# EAGLE board main_smd_first_draft (EAGLE 9.0.0), part 1 of 2
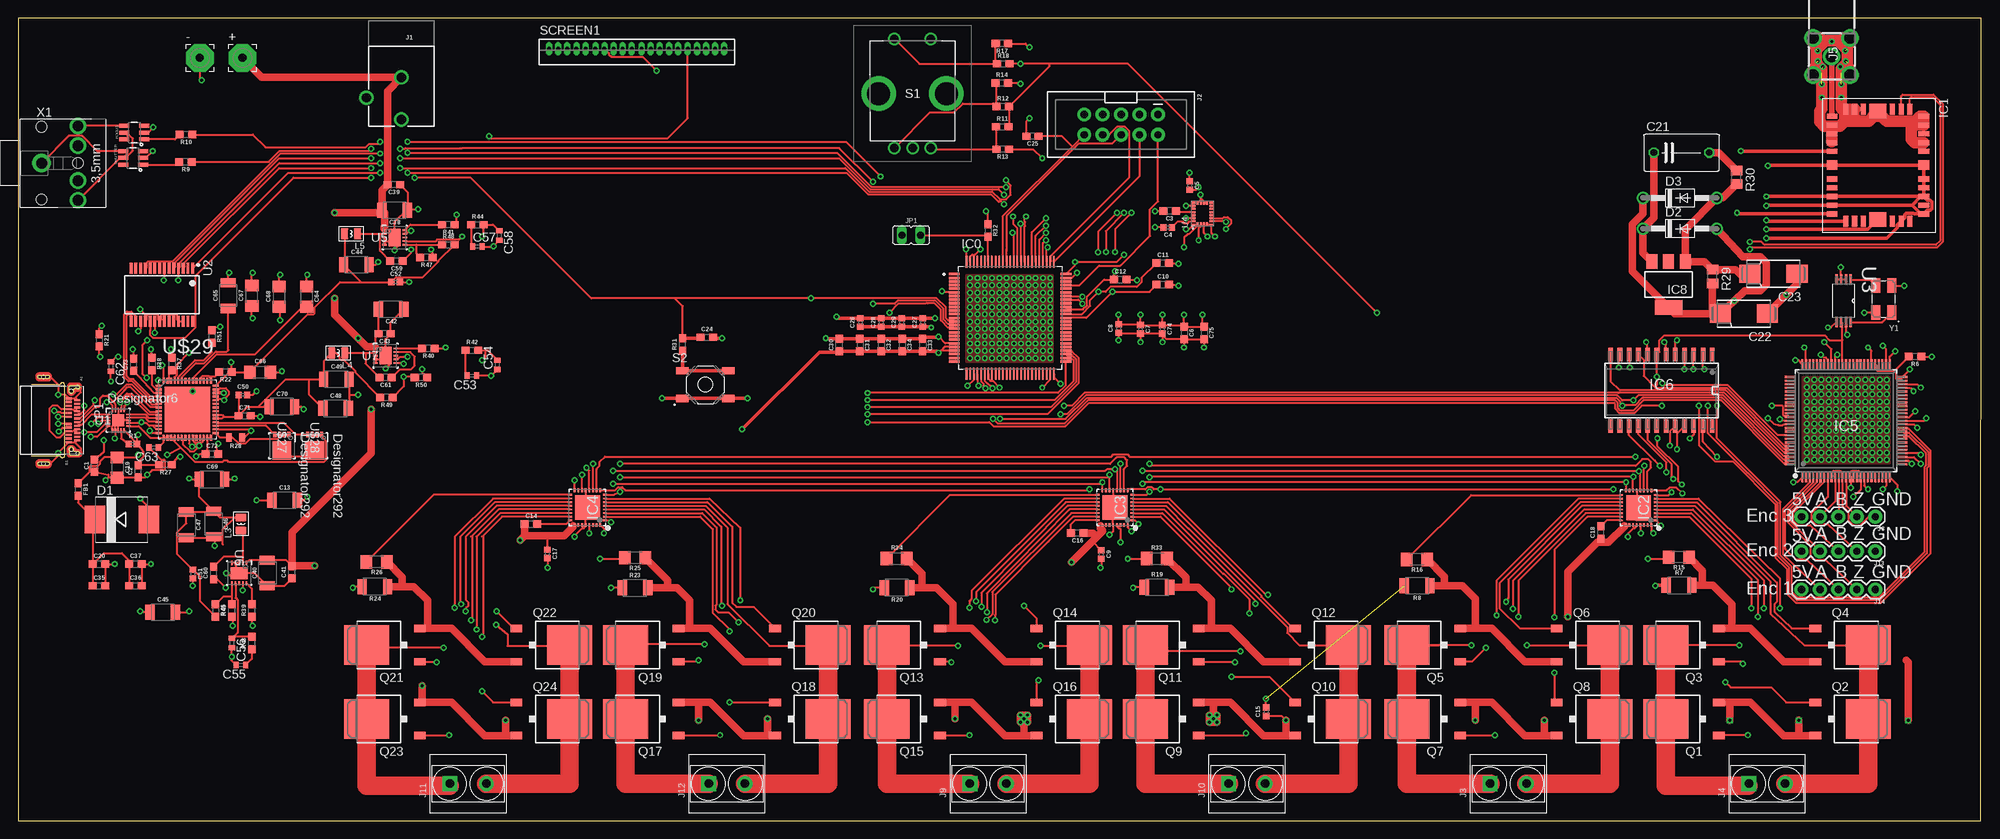
[diagram p9: board, top side]
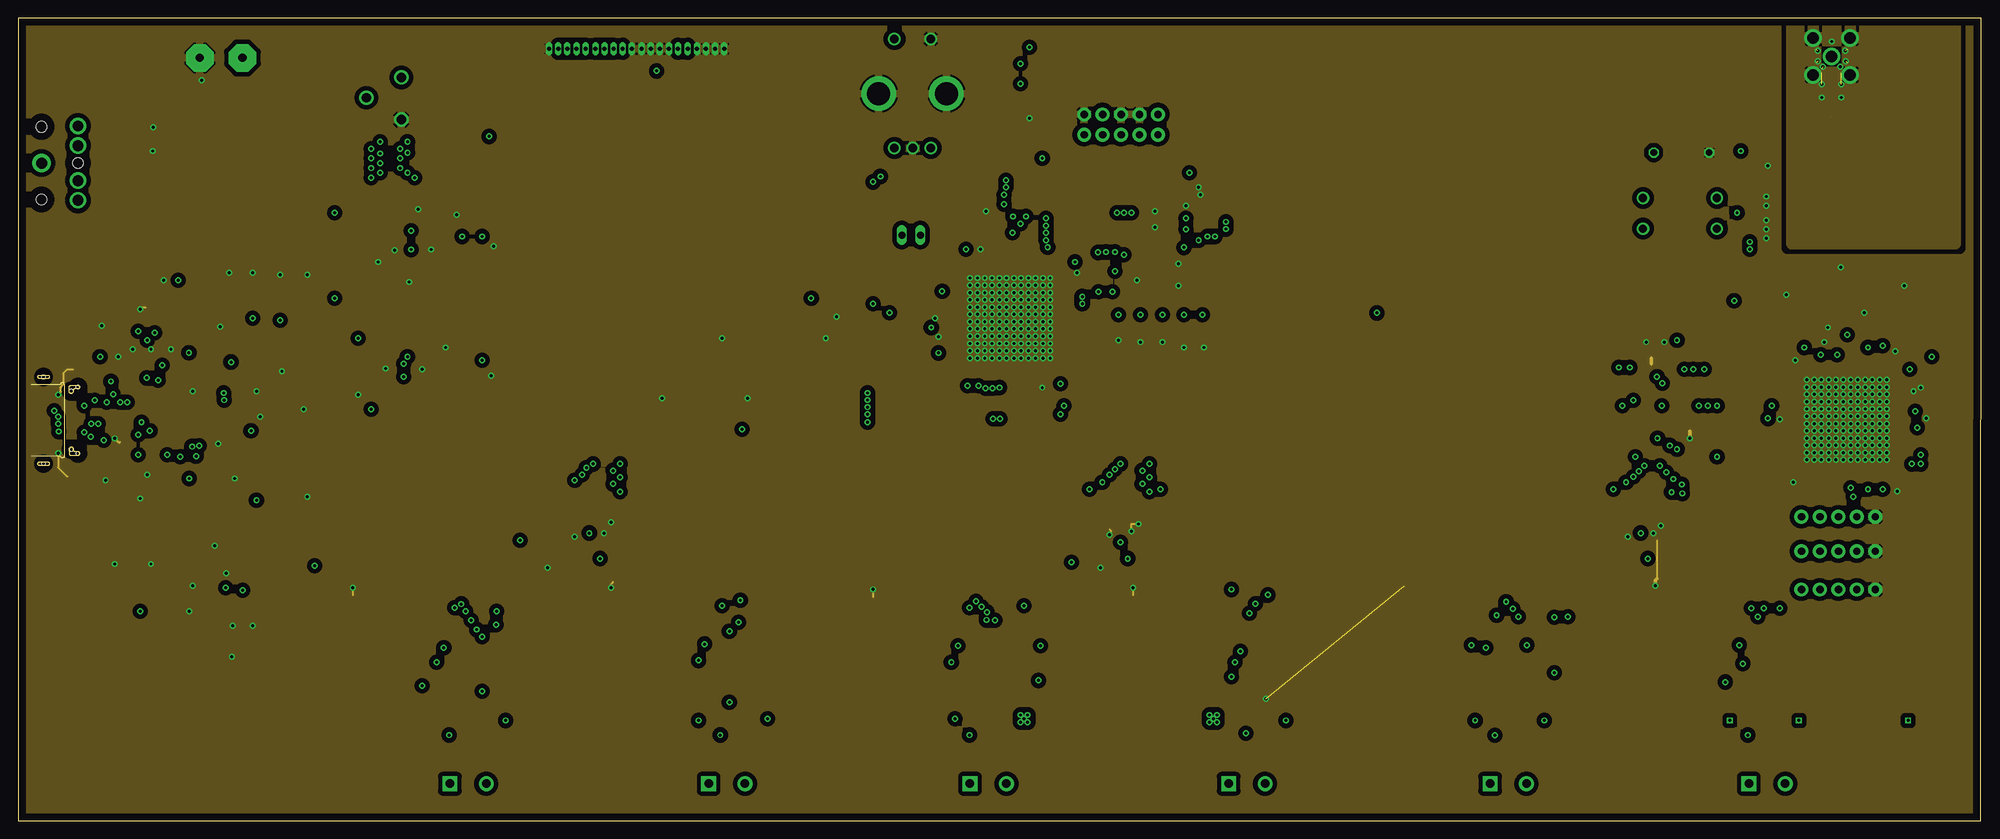
[diagram p10: board, inner layer Route2]
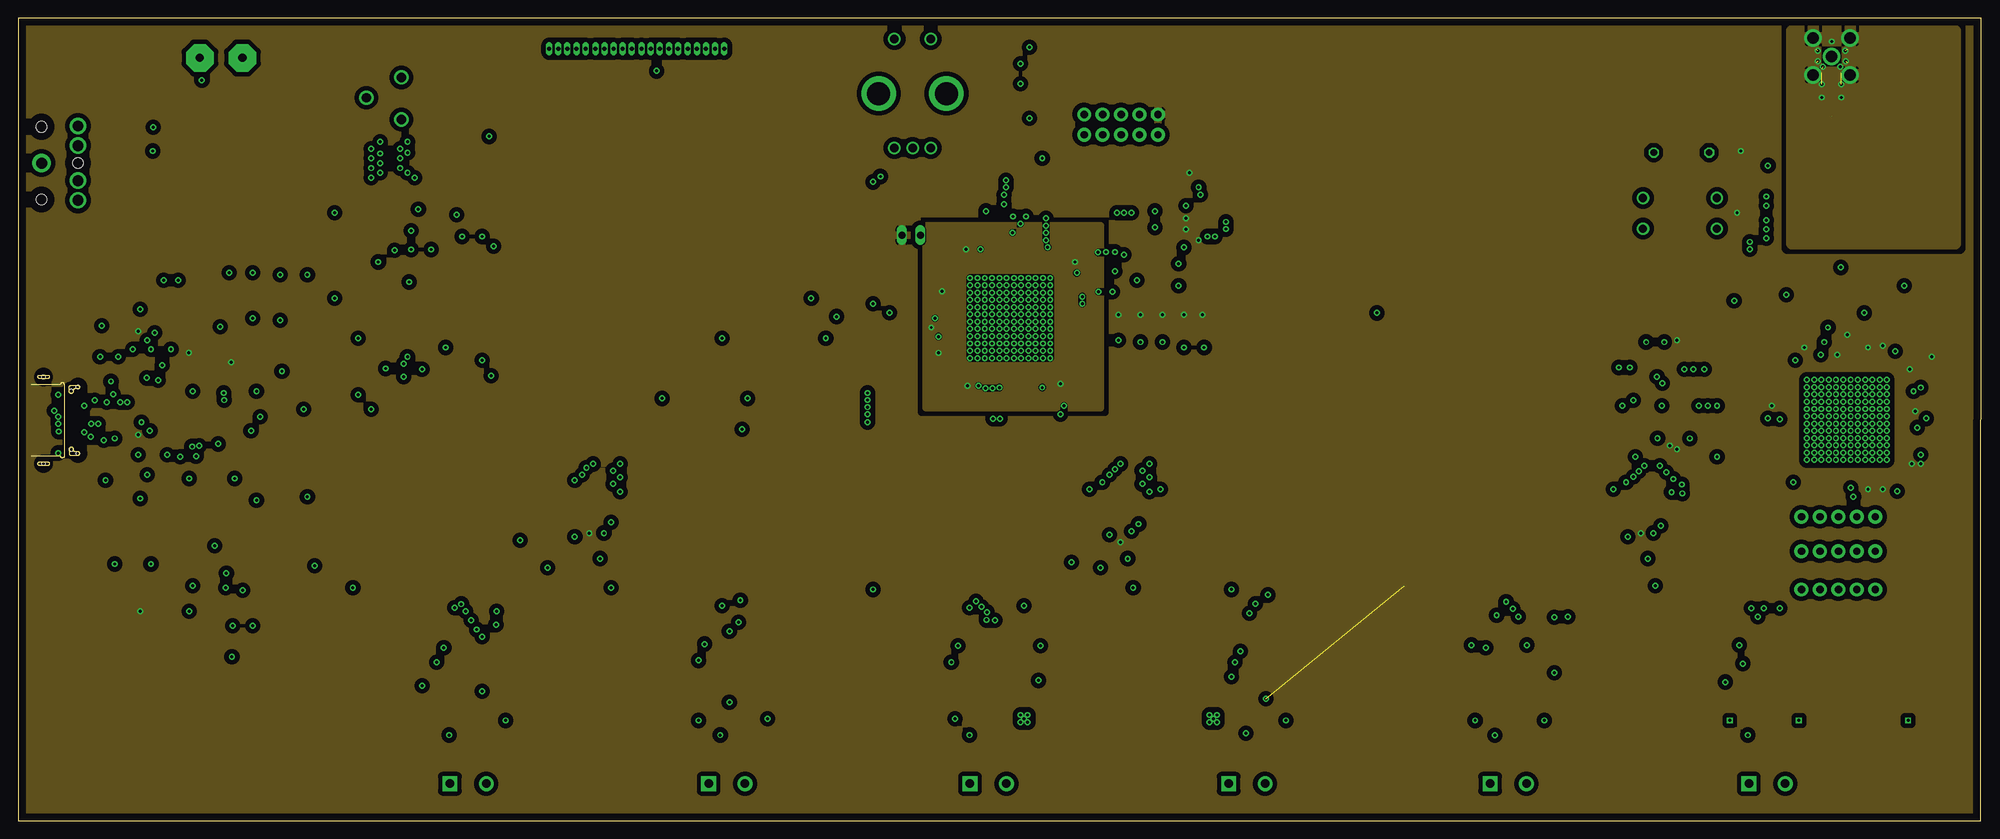
[diagram p11: board, inner layer Route3]
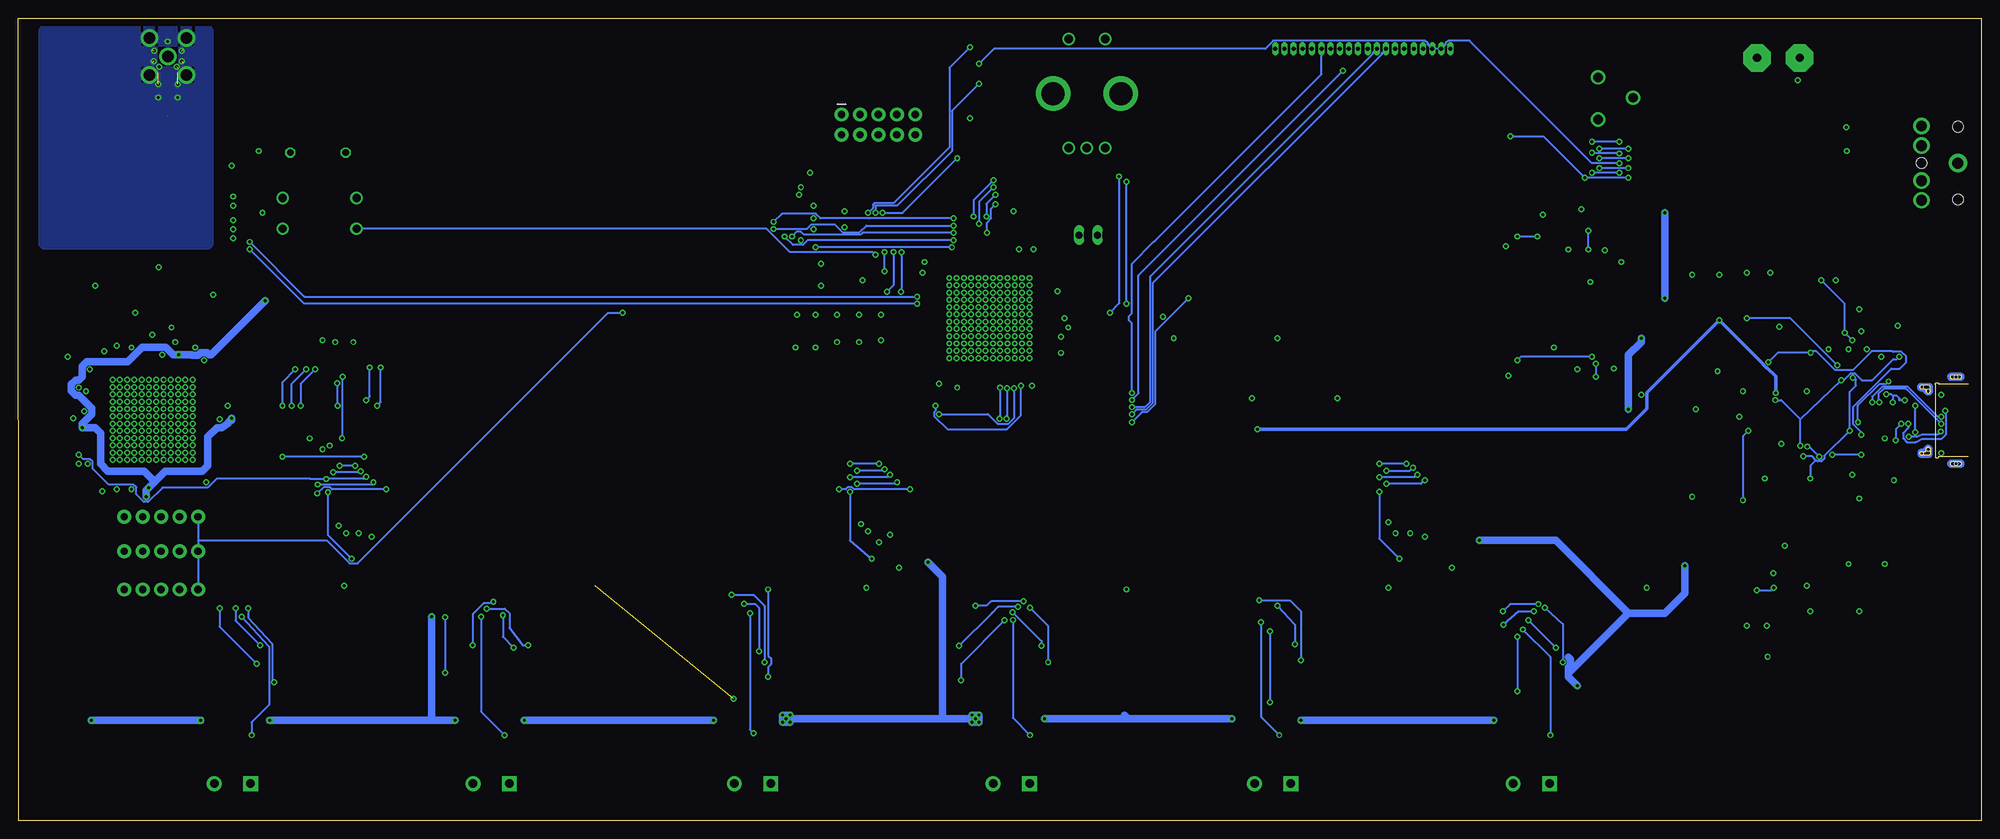
[diagram p12: board, bottom side, seen from below]

Size 269.82 x 110.27 mm. Coordinates in mm from the lower left corner, seen from the top.
Outline: 0,0 269.77,0 269.82,110.27 0,110.27 0,0
Copper layers (1+(2*3)+16): Top 0.035mm / dielectric 0.204mm / Route2 0.017mm / dielectric 0.252mm / Route3 0.017mm / dielectric 0.2mm / Bottom 0.035mm
Design rules "default *": minimum track width 3.5mil, minimum drill 16mil, track to track 3.5mil, track to pad 3.5mil, pad to pad 6mil, via to via 6mil, smd to smd 6mil, copper to edge 40mil, drill to drill 6mil, minimum pad ring 3mil, minimum via ring 8mil, stop-mask expansion 4mil, vias tented up to drill 0mil, thermal gap 10mil
Net classes: 1 differential: width 0.254 mm; 2 ground: width 0.254 mm; 3 power: width 0.254 mm; 4 rf: width 0.787 mm, clearance 0.152 mm; 5 rf_gnd: width 1.575 mm, clearance 0.152 mm

## Footprints (pad centres in the part's own frame; a part is rotated, then mirrored left to right if it is on the bottom)
3,81/1,1 = drill 1.118 pad 3.81 octagon: 1 0,0
0603 = smd 1.1 x 1: 1 -0.85,0; 2 0.85,0
0402 = smd 0.85 x 0.9: 1 -0.58,0; 2 0.58,0
1210 = smd 1.27 x 2.06: 1 -1.755,0; 2 1.755,0
1206 = smd 1.6 x 1.8: 1 -1.4,0; 2 1.4,0
C075-052X106 = drill 0.914 octagon: 1 -3.81,0; 2 3.81,0
085CS_1AR = smd 2.9 x 2.5: + 3.25,0; - -3.25,0
C0402 = smd 0.7 x 0.9: 1 -0.65,0; 2 0.65,0
SMC = smd 2.8 x 3.8: A 3.7,0; C -3.7,0
DO41-10 = drill 1.118: A 5.08,0; C -5.08,0
SOT23-6 = smd 0.55 x 1.35: 1 -0.95,-1.375; 2 0,-1.375; 3 0.95,-1.375; 4 0.95,1.375; 5 0,1.375; 6 -0.95,1.375
QFP50P1600X1600X160-100N = smd 1.56 x 0.28: 1 -7.68,6; 2 -7.68,5.5; 3 -7.68,5; 4 -7.68,4.5; 5 -7.68,4; 6 -7.68,3.5; 7 -7.68,3; 8 -7.68,2.5; 9 -7.68,2; 10 -7.68,1.5; 11 -7.68,1; 12 -7.68,0.5; 13 -7.68,0; 14 -7.68,-0.5; 15 -7.68,-1; 16 -7.68,-1.5; 17 -7.68,-2; 18 -7.68,-2.5; 19 -7.68,-3; 20 -7.68,-3.5; 21 -7.68,-4; 22 -7.68,-4.5; 23 -7.68,-5; 24 -7.68,-5.5; 25 -7.68,-6; 51 7.68,-6; 52 7.68,-5.5; 53 7.68,-5; 54 7.68,-4.5; 55 7.68,-4; 56 7.68,-3.5; 57 7.68,-3; 58 7.68,-2.5; 59 7.68,-2; 60 7.68,-1.5; 61 7.68,-1; 62 7.68,-0.5; 63 7.68,0; 64 7.68,0.5; 65 7.68,1; 66 7.68,1.5; 67 7.68,2; 68 7.68,2.5; 69 7.68,3; 70 7.68,3.5; 71 7.68,4; 72 7.68,4.5; 73 7.68,5; 74 7.68,5.5; 75 7.68,6 | smd 0.28 x 1.56: 26 -6,-7.68; 27 -5.5,-7.68; 28 -5,-7.68; 29 -4.5,-7.68; 30 -4,-7.68; 31 -3.5,-7.68; 32 -3,-7.68; 33 -2.5,-7.68; 34 -2,-7.68; 35 -1.5,-7.68; 36 -1,-7.68; 37 -0.5,-7.68; 38 0,-7.68; 39 0.5,-7.68; 40 1,-7.68; 41 1.5,-7.68; 42 2,-7.68; 43 2.5,-7.68; 44 3,-7.68; 45 3.5,-7.68; 46 4,-7.68; 47 4.5,-7.68; 48 5,-7.68; 49 5.5,-7.68; 50 6,-7.68; 76 6,7.68; 77 5.5,7.68; 78 5,7.68; 79 4.5,7.68; 80 4,7.68; 81 3.5,7.68; 82 3,7.68; 83 2.5,7.68; 84 2,7.68; 85 1.5,7.68; 86 1,7.68; 87 0.5,7.68; 88 0,7.68; 89 -0.5,7.68; 90 -1,7.68; 91 -1.5,7.68; 92 -2,7.68; 93 -2.5,7.68; 94 -3,7.68; 95 -3.5,7.68; 96 -4,7.68; 97 -4.5,7.68; 98 -5,7.68; 99 -5.5,7.68; 100 -6,7.68
S1315F8_SMT = smd 0.7 x 1.5: 1 -6.75,-6.2; 2 -5.55,-6.2; 3 -4.35,-6.2; 4 -3.15,-6.2; 5 -1.95,-6.2; 7 1.85,-6.2; 8 3.05,-6.2; 9 4.25,-6.2; 10 5.45,-6.2; 11 6.65,-6.2; 19 6.65,6.4; 20 5.45,6.4; 21 4.25,6.4; 22 3.05,6.4; 23 1.85,6.4; 25 -1.95,6.4; 26 -3.15,6.4; 27 -4.35,6.4; 28 -5.55,6.4; 29 -6.75,6.4 | smd 1.3 x 1.5: 6 -0.05,-6.2; 24 -0.05,6.4 | smd 1.5 x 0.7: 12 7.65,-4.3; 13 7.65,-3.1; 14 7.65,-1.9; 16 7.65,2.1; 17 7.65,3.3; 18 7.65,4.5; 30 -7.75,4.5; 31 -7.75,3.3; 32 -7.75,2.1; 34 -7.75,-1.9; 35 -7.75,-3.1; 36 -7.75,-4.3 | smd 2 x 2.3: 15 7.398,0.1; 33 -7.475,0.1
TMC_QFN32_0.5_5.0X5.0 = smd 0.254 x 0.5: 1 -1.75,-2.385; 2 -1.25,-2.385; 3 -0.75,-2.385; 4 -0.25,-2.385; 5 0.25,-2.385; 6 0.75,-2.385; 7 1.25,-2.385; 8 1.75,-2.385; 17 1.75,2.385; 18 1.25,2.385; 19 0.75,2.385; 20 0.25,2.385; 21 -0.25,2.385; 22 -0.75,2.385; 23 -1.25,2.385; 24 -1.75,2.385 | smd 0.5 x 0.254: 9 2.385,-1.75; 10 2.385,-1.25; 11 2.385,-0.75; 12 2.385,-0.25; 13 2.385,0.25; 14 2.385,0.75; 15 2.385,1.25; 16 2.385,1.75; 25 -2.385,1.75; 26 -2.385,1.25; 27 -2.385,0.75; 28 -2.385,0.25; 29 -2.385,-0.25; 30 -2.385,-0.75; 31 -2.385,-1.25; 32 -2.385,-1.75 | smd 3.4 x 3.4: 33 0,0
TMC_TQFP100_0.5_14X14 = smd 0.3 x 1.34: 1 -6,-7.773; 2 -5.5,-7.773; 3 -5,-7.773; 4 -4.5,-7.773; 5 -4,-7.773; 6 -3.5,-7.773; 7 -3,-7.773; 8 -2.5,-7.773; 9 -2,-7.773; 10 -1.5,-7.773; 11 -1,-7.773; 12 -0.5,-7.773; 13 0,-7.773; 14 0.5,-7.773; 15 1,-7.773; 16 1.5,-7.773; 17 2,-7.773; 18 2.5,-7.773; 19 3,-7.773; 20 3.5,-7.773; 21 4,-7.773; 22 4.5,-7.773; 23 5,-7.773; 24 5.5,-7.773; 25 6,-7.773; 51 6,7.773; 52 5.5,7.773; 53 5,7.773; 54 4.5,7.773; 55 4,7.773; 56 3.5,7.773; 57 3,7.773; 58 2.5,7.773; 59 2,7.773; 60 1.5,7.773; 61 1,7.773; 62 0.5,7.773; 63 0,7.773; 64 -0.5,7.773; 65 -1,7.773; 66 -1.5,7.773; 67 -2,7.773; 68 -2.5,7.773; 69 -3,7.773; 70 -3.5,7.773; 71 -4,7.773; 72 -4.5,7.773; 73 -5,7.773; 74 -5.5,7.773; 75 -6,7.773 | smd 1.34 x 0.3: 26 7.773,-6; 27 7.773,-5.5; 28 7.773,-5; 29 7.773,-4.5; 30 7.773,-4; 31 7.773,-3.5; 32 7.773,-3; 33 7.773,-2.5; 34 7.773,-2; 35 7.773,-1.5; 36 7.773,-1; 37 7.773,-0.5; 38 7.773,0; 39 7.773,0.5; 40 7.773,1; 41 7.773,1.5; 42 7.773,2; 43 7.773,2.5; 44 7.773,3; 45 7.773,3.5; 46 7.773,4; 47 7.773,4.5; 48 7.773,5; 49 7.773,5.5; 50 7.773,6; 76 -7.773,6; 77 -7.773,5.5; 78 -7.773,5; 79 -7.773,4.5; 80 -7.773,4; 81 -7.773,3.5; 82 -7.773,3; 83 -7.773,2.5; 84 -7.773,2; 85 -7.773,1.5; 86 -7.773,1; 87 -7.773,0.5; 88 -7.773,0; 89 -7.773,-0.5; 90 -7.773,-1; 91 -7.773,-1.5; 92 -7.773,-2; 93 -7.773,-2.5; 94 -7.773,-3; 95 -7.773,-3.5; 96 -7.773,-4; 97 -7.773,-4.5; 98 -7.773,-5; 99 -7.773,-5.5; 100 -7.773,-6
TMC_SO24_SOT137-1_1.27_15.5X7.5 = smd 0.63 x 1.8: 1 -6.985,-4.912; 2 -5.715,-4.912; 3 -4.445,-4.912; 4 -3.175,-4.912; 5 -1.905,-4.912; 6 -0.635,-4.912; 7 0.635,-4.912; 8 1.905,-4.912; 9 3.175,-4.912; 10 4.445,-4.912; 11 5.715,-4.912; 12 6.985,-4.912; 13 6.985,4.912; 14 5.715,4.912; 15 4.445,4.912; 16 3.175,4.912; 17 1.905,4.912; 18 0.635,4.912; 19 -0.635,4.912; 20 -1.905,4.912; 21 -3.175,4.912; 22 -4.445,4.912; 23 -5.715,4.912; 24 -6.985,4.912
SOT223 = smd 1.5 x 2: 1 -2.3,-3.15; 2 0,-3.15; 3 2.3,-3.15 | smd 3.8 x 2: 4 0,3.15
POWER_JACK_PTH_BREAD = drill 1.3: GND 0,7.9; GNDBREAK 4.8,10.7; PWR 0,13.7
2X5-SHROUDED_LOCK = drill 1.016 pad 1.88: 1 -1.397,5.08; 2 1.397,5.08; 3 -1.397,2.54; 4 1.397,2.54; 5 -1.397,0; 6 1.397,0; 7 -1.397,-2.54; 8 1.397,-2.54; 9 -1.397,-5.08; 10 1.397,-5.08
H2-5.0-10.5X8.0MM = drill 1.168 pad 2.032 square: 1 0,2.5 | drill 1.168 pad 2.032: 2 0,-2.5
73100-0114 = drill 1.59 pad 2.39: 1 0,0; 2 -2.54,2.54; 3 2.54,2.54; 4 2.54,-2.54; 5 -2.54,-2.54
1X05 = drill 1.016 pad 1.88: 1 0,0; 2 2.54,0; 3 5.08,0; 4 7.62,0; 5 10.16,0
JP1 = drill 0.914 long: 1 0,-1.27; 2 0,1.27
L0806 = smd 1.016 x 1.524: 1 -0.889,0; 2 0.889,0
TE_1-2295018-2 = smd 0.3 x 0.8: A1 -2.75,4.63; A2 -2.25,4.63; A3 -1.75,4.63; A4 -1.25,4.63; A5 -0.75,4.63; A6 -0.25,4.63; A7 0.25,4.63; A8 0.75,4.63; A9 1.25,4.63; A10 1.75,4.63; A11 2.25,4.63; A12 2.75,4.63; B1 3,3.43; B2 2.5,3.43; B3 2,3.43; B4 1.5,3.43; B5 1,3.43; B6 0.5,3.43; B7 -0.5,3.43; B8 -1,3.43; B9 -1.5,3.43; B10 -2,3.43; B11 -2.5,3.43; B12 -3,3.43 | smd 0.1 x 0.1: S1 -4.6,5.1; S2 4.6,5.1; S3 6,0.9; S4 -6,0.9 | hole 0.5: -4.55,4.695; 4.55,4.695; -5.97,0; 5.97,0 | hole 0.6: -4,3.795; 4,3.795
TO252 = smd 5.4 x 6.2: C 0,2.5 | smd 1 x 1.6: L -2.28,-4.8; R 2.28,-4.8
0805 = smd 0.8 x 1.2: 1 -0.9,0; 2 0.9,0
M0805 = smd 1.3 x 1.6: 1 -0.95,0; 2 0.95,0
EN11HSM1BF20 = drill 1.15 pad 1.725: 1 -2.5,-7.5; 2 0,-7.5; 3 2.5,-7.5; 4 -2.5,7.5; 5 2.5,7.5 | drill 3.162 pad 4.743: 6 -4.65,0; 7 4.65,0
SW_TL3342F160QG = smd 1.7 x 1: 1 -3.15,-1.9; 2 3.15,-1.9; 3 -3.15,1.9; 4 3.15,1.9
SIP-20 = drill 0.6 pad 0.7 long: 1 -2.5,0; 2 -1.25,0; 3 0,0; 4 1.25,0; 5 2.5,0; 6 3.85,0; 7 5.1,0; 8 6.35,0; 9 7.6,0; 10 8.85,0; 11 10.2,0; 12 11.45,0; 13 12.7,0; 14 13.95,0; 15 15.2,0; 16 16.55,0; 17 17.8,0; 18 19.05,0; 19 20.3,0; 20 21.55,0
RUK0020B_NV = smd 0.6 x 0.2: 1 -1.4,0.8; 2 -1.4,0.4; 3 -1.4,0; 4 -1.4,-0.4; 5 -1.4,-0.8; 11 1.4,-0.8; 12 1.4,-0.4; 13 1.4,0; 14 1.4,0.4; 15 1.4,0.8 | smd 0.2 x 0.6: 6 -0.8,-1.4; 7 -0.4,-1.4; 8 0,-1.4; 9 0.4,-1.4; 10 0.8,-1.4; 16 0.8,1.4; 17 0.4,1.4; 18 0,1.4; 19 -0.4,1.4; 20 -0.8,1.4 | smd 1.7 x 1.7: 21 0,0
SOP65P780X200-28N = smd 1.5 x 0.4: 1 -3.625,4.225; 2 -3.625,3.575; 3 -3.625,2.925; 4 -3.625,2.275; 5 -3.625,1.625; 6 -3.625,0.975; 7 -3.625,0.325; 8 -3.625,-0.325; 9 -3.625,-0.975; 10 -3.625,-1.625; 11 -3.625,-2.275; 12 -3.625,-2.925; 13 -3.625,-3.575; 14 -3.625,-4.225; 15 3.625,-4.225; 16 3.625,-3.575; 17 3.625,-2.925; 18 3.625,-2.275; 19 3.625,-1.625; 20 3.625,-0.975; 21 3.625,-0.325; 22 3.625,0.325; 23 3.625,0.975; 24 3.625,1.625; 25 3.625,2.275; 26 3.625,2.925; 27 3.625,3.575; 28 3.625,4.225
SOP65P640X120-8N = smd 1.473 x 0.356: 1 -2.921,0.965; 2 -2.921,0.33; 3 -2.921,-0.33; 4 -2.921,-0.965; 5 2.921,-0.965; 6 2.921,-0.33; 7 2.921,0.33; 8 2.921,0.965
PQFN24P43_350X300X102L35X23N = smd 0.28 x 0.53: 1 -1.505,1.225; 6 -1.505,-1.225; 7 -1.075,-1.225; 8 -0.645,-1.225; 9 -0.215,-1.225; 10 0.215,-1.225; 11 0.645,-1.225; 12 1.075,-1.225; 13 1.505,-1.225; 18 1.505,1.225; 19 1.075,1.225; 20 0.645,1.225; 21 0.215,1.225; 22 -0.215,1.225; 23 -0.645,1.225; 24 -1.075,1.225 | smd 0.53 x 0.28: 2 -1.47,0.645; 3 -1.47,0.215; 4 -1.47,-0.215; 5 -1.47,-0.645; 14 1.47,-0.645; 15 1.47,-0.215; 16 1.47,0.215; 17 1.47,0.645
DRC0010J = smd 0.6 x 0.24: 1 -1.4,1; 2 -1.4,0.5; 3 -1.4,0; 4 -1.4,-0.5; 5 -1.4,-1; 6 1.4,-1; 7 1.4,-0.5; 8 1.4,0; 9 1.4,0.5; 10 1.4,1 | smd 1.65 x 2.4: 11 0,0 | smd 0.5 x 0.5: V 0,-0.95
DQG0008A = smd 0.75 x 0.44: 1 -1.525,0.975; 2 -1.525,0.325; 3 -1.525,-0.325; 4 -1.525,-0.975; 5 1.525,-0.975; 6 1.525,-0.325; 7 1.525,0.325; 8 1.525,0.975 | smd 2.5 x 2.55: 9 0.65,0 | smd 0.5 x 0.5: V 0.226,0.975
QFN50P800X800X100-57N = smd 0.813 x 0.305: 1 -3.912,3.251; 2 -3.912,2.743; 3 -3.912,2.261; 4 -3.912,1.753; 5 -3.912,1.245; 6 -3.912,0.762; 7 -3.912,0.254; 8 -3.912,-0.254; 9 -3.912,-0.762; 10 -3.912,-1.245; 11 -3.912,-1.753; 12 -3.912,-2.261; 13 -3.912,-2.743; 14 -3.912,-3.251; 29 3.912,-3.251; 30 3.912,-2.743; 31 3.912,-2.261; 32 3.912,-1.753; 33 3.912,-1.245; 34 3.912,-0.762; 35 3.912,-0.254; 36 3.912,0.254; 37 3.912,0.762; 38 3.912,1.245; 39 3.912,1.753; 40 3.912,2.261; 41 3.912,2.743; 42 3.912,3.251 | smd 0.305 x 0.813: 15 -3.251,-3.912; 16 -2.743,-3.912; 17 -2.261,-3.912; 18 -1.753,-3.912; 19 -1.245,-3.912; 20 -0.762,-3.912; 21 -0.254,-3.912; 22 0.254,-3.912; 23 0.762,-3.912; 24 1.245,-3.912; 25 1.753,-3.912; 26 2.261,-3.912; 27 2.743,-3.912; 28 3.251,-3.912; 43 3.251,3.912; 44 2.743,3.912; 45 2.261,3.912; 46 1.753,3.912; 47 1.245,3.912; 48 0.762,3.912; 49 0.254,3.912; 50 -0.254,3.912; 51 -0.762,3.912; 52 -1.245,3.912; 53 -1.753,3.912; 54 -2.261,3.912; 55 -2.743,3.912; 56 -3.251,3.912 | smd 6.248 x 6.248: 57 0,0
STX3100 = drill 1.5 pad 2.54: 1 2.7,-0.1 | drill 1.5: 2 7.7,5; 3 7.7,2.3; 4 7.7,-2.5; 5 7.7,-5.2 | hole 1.5: 2.7,4.9; 2.7,-5.1; 7.7,-0.1
7B-16.000MAAJ-T_OSCSC500X320X105-4N = smd 1.2 x 2: 1 -1.1,1.85; 2 -1.1,-1.85; 3 1.1,-1.85; 4 1.1,1.85

## Placement (x,y rotation side)
+  [3,81/1,1]  30.82,104.81 0 top
-  [3,81/1,1]  24.97,104.81 0 top
C1  0.1uF  [0603]  10.5,48.77 90 top
C2  1.0uF  [0603]  16.5,48.02 90 top
C3  10nF  [0603]  158.25,83.77 180 top
C4  0.1uF  [0402]  158,81.52 180 top
C5  0.1uF  [0402]  161,87.27 270 top
C6  10uF  [0603]  160.25,67.02 270 top
C7  0.1uF  [0402]  154.25,67.52 270 top
C8  470nF  [0402]  151.25,67.64 90 top
C9  0.1uF  [0402]  148.87,36.59 270 top
C10  10nF  [0603]  157.33,73.66 0 top
C11  10nF  [0603]  157.32,76.63 0 top
C12  10nF  [0603]  151.48,74.35 0 top
C13  10uF  [1210]  36.62,44.02 0 top
C14  0.22uF  [0603]  70.48,40.77 0 top
C15  0.1uF  [0402]  171.52,14.97 90 top
C16  0.22uF  [0603]  145.58,39.52 180 top
C17  0.1uF  [0402]  72.74,36.67 270 top
C18  0.22uF  [0603]  217.52,39.59 90 top
C19  1.0uF  [1206]  13.62,48.52 270 top
C20  10nF  [0603]  11.12,35.27 0 top
C21  0.1uF  [C075-052X106]  228.61,91.81 0 top
C22  1uF  [085CS_1AR]  237.18,69.68 180 top
C23  10uF  [085CS_1AR]  241.25,75.16 180 top
C24  10nF  [0603]  94.63,66.43 0 top
C25  10nF  [0603]  139.41,94.06 180 top
C26  0.1uF  [0402]  115.77,68.45 90 top
C27  0.1uF  [0402]  124.33,68.45 90 top
C28  0.1uF  [0402]  118.64,68.45 90 top
C29  0.1uF  [0402]  121.45,68.45 90 top
C30  4.7uF  [0603]  112.86,65.35 90 top
C31  10nF  [0603]  115.68,65.34 270 top
C32  10nF  [0603]  118.62,65.34 270 top
C33  0.1uF  [0603]  124.31,65.34 270 top
C34  0.1uF  [0603]  121.5,65.34 270 top
C35  10nF  [0603]  11.12,32.27 0 top
C36  10nF  [0603]  16.12,32.27 0 top
C37  10nF  [0603]  16.12,35.27 0 top
C38  10uF  [1210]  51.75,83.89 180 top
C39  0.1uF  [0603]  51.62,87.39 180 top
C40  10uF  [1210]  34.25,34.02 90 top
C41  0.1uF  [0603]  37.62,34.15 90 top
C42  10uF  [1210]  51.25,70.27 180 top
C43  0.1uF  [0603]  50.38,66.89 180 top
C44  22UF-1210-16V-20%  [1210]  46.5,76.39 0 top
C45  22UF-1210-16V-20%  [1210]  19.88,28.64 0 top
C46  22UF-1210-16V-20%  [1210]  26.88,40.77 270 top
C47  22UF-1210-16V-20%  [1210]  23.12,40.65 270 top
C48  22UF-1210-16V-20%  [1210]  43.62,56.65 0 top
C49  22UF-1210-16V-20%  [1210]  43.75,60.65 0 top
C50  0.1uF  [0402]  30.88,58.52 0 top
C51  0.1uF  [0402]  24,33.9 270 top
C52  0.1uF  [0402]  51.88,74.02 0 top
C53  1800pF  [C0402]  62.38,61.15 180 top
C54  91pF  [C0402]  65.88,62.65 90 top
C55  2200pF  [C0402]  30.62,21.39 180 top
C56  100pF  [C0402]  29.38,24.39 270 top
C57  5600pF  [C0402]  63.12,78.89 0 top
C58  330pF  [C0402]  66.12,80.39 270 top
C59  0.1uF  [0603]  52,76.89 180 top
C60  0.1uF  [0603]  26.88,34.02 90 top
C61  0.1uF  [0603]  50.5,60.9 180 top
C62  220pF  [C0402]  12.75,62.4 270 top
C63  220pF  [C0402]  18.62,51.27 180 top
C64  1.0uF  [1206]  39.62,72.02 270 top
C65  10uF  [1210]  28.88,72.14 90 top
C66  1.0uF  [1206]  33.25,61.65 0 top
C67  1.0uF  [1206]  32.12,72.14 90 top
C68  1.0uF  [1206]  35.88,72.02 90 top
C69  22UF-1210-16V-20%  [1210]  26.62,46.9 0 top
C70  10uF  [1210]  36.25,56.9 0 top
C71  0.1uF  [0603]  31.12,55.65 0 top
C72  0.1uF  [0603]  26.62,50.4 0 top
C73  0.22uF  [0603]  15.88,62.65 90 top
C74  1.0uF  [0402]  157.25,67.52 270 top
C75  10nF  [0603]  163,67.02 270 top
D1  MBRS340T3  [SMC]  14.25,41.4 0 top
D2  1N4002  [DO41-10]  228.4,81.35 0 top
D3  1N4002  [DO41-10]  228.4,85.57 0 top
FB1  30Ω/1.8A  [0603]  8.25,45.52 270 top
FOCUS  4N35S  [SOT23-6]  15.96,94.56 90 top
IC0  STM32F313VCT6  [QFP50P1600X1600X160-100N]  136.34,69.1 0 top
IC1  S1315F8_RAW  [S1315F8_SMT]  255.5,90.02 270 top
IC2  TMC262-LA  [TMC_QFN32_0.5_5.0X5.0]  222.7,43 90 top
IC3  TMC262-LA  [TMC_QFN32_0.5_5.0X5.0]  150.75,43.02 90 top
IC4  TMC262-LA  [TMC_QFN32_0.5_5.0X5.0]  78.25,43.02 90 top
IC5  TMC424  [TMC_TQFP100_0.5_14X14]  251.23,54.97 0 top
IC6  TMC429-PI24  [TMC_SO24_SOT137-1_1.27_15.5X7.5]  225.85,59.14 180 top
IC8  LM317MBSTT3  [SOT223]  226.83,73.67 180 top
J1  POWER_JACKPTH_BREAD  [POWER_JACK_PTH_BREAD]  52.66,110.04 180 top
J2  [2X5-SHROUDED_LOCK]  151.58,95.65 270 top
J3  Motor Coil B  [H2-5.0-10.5X8.0MM]  204.81,5.08 90 top
J4  Motor Coil A  [H2-5.0-10.5X8.0MM]  240.37,5.08 90 top
J5  73100-0114  [73100-0114]  249.25,105.02 270 top
J8  [1X05]  255.25,41.77 180 top
J9  Motor Coil B  [H2-5.0-10.5X8.0MM]  133.32,5.08 90 top
J10  Motor Coil A  [H2-5.0-10.5X8.0MM]  168.88,5.08 90 top
J11  Motor Coil B  [H2-5.0-10.5X8.0MM]  61.84,5.08 90 top
J12  Motor Coil A  [H2-5.0-10.5X8.0MM]  97.4,5.08 90 top
J13  [1X05]  255.25,37.02 180 top
J14  [1X05]  255.25,31.77 180 top
JP1  [JP1]  122.74,80.45 90 top
L3  10UH-225MA  [L0806]  30.62,40.77 90 top
L4  10UH-225MA  [L0806]  44,64.27 180 top
L5  10UH-225MA  [L0806]  45.75,80.64 180 top
P1  1-2295018-2  [TE_1-2295018-2]  3.5,55.02 270 top
Q1  AOD4189  [TO252]  228.94,13.97 90 top
Q2  AOD4189  [TO252]  251.8,13.97 270 top
Q3  AOD4184A  [TO252]  228.94,24.13 90 top
Q4  AOD4184A  [TO252]  251.8,24.13 270 top
Q5  AOD4184A  [TO252]  193.38,24.13 90 top
Q6  AOD4184A  [TO252]  216.24,24.13 270 top
Q7  AOD4189  [TO252]  193.38,13.97 90 top
Q8  AOD4189  [TO252]  216.24,13.97 270 top
Q9  AOD4189  [TO252]  157.45,13.97 90 top
Q10  AOD4189  [TO252]  180.31,13.97 270 top
Q11  AOD4184A  [TO252]  157.45,24.13 90 top
Q12  AOD4184A  [TO252]  180.31,24.13 270 top
Q13  AOD4184A  [TO252]  121.89,24.13 90 top
Q14  AOD4184A  [TO252]  144.75,24.13 270 top
Q15  AOD4189  [TO252]  121.89,13.97 90 top
Q16  AOD4189  [TO252]  144.75,13.97 270 top
Q17  AOD4189  [TO252]  85.97,13.97 90 top
Q18  AOD4189  [TO252]  108.83,13.97 270 top
Q19  AOD4184A  [TO252]  85.97,24.13 90 top
Q20  AOD4184A  [TO252]  108.83,24.13 270 top
Q21  AOD4184A  [TO252]  50.41,24.13 90 top
Q22  AOD4184A  [TO252]  73.27,24.13 270 top
Q23  AOD4189  [TO252]  50.41,13.97 90 top
Q24  AOD4189  [TO252]  73.27,13.97 270 top
R1  100K  [0402]  15.75,51.77 0 top
R6  10k  [0603]  260.7,63.77 180 top
R7  0.1  [1210]  228.26,32.33 0 top
R8  0.1  [1210]  192.26,32.27 180 top
R9  220  [0603]  23.01,90.52 180 top
R10  220  [0603]  23.07,94.27 180 top
R11  10k  [0603]  135.26,95.35 0 top
R12  10k  [0603]  135.33,98.13 0 top
R13  10k  [0603]  135.32,92.26 180 top
R14  10k  [0603]  135.18,101.38 0 top
R15  10  [1206]  228.26,36.2 180 top
R16  10  [1206]  192.26,35.89 180 top
R17  10k  [0603]  135.21,106.79 180 top
R18  10k  [0603]  135.38,104 0 top
R19  0.1  [1210]  156.51,32.09 0 top
R20  0.1  [1210]  120.78,32.03 180 top
R21  1M  [0603]  11.12,66.02 270 top
R22  10k  [0603]  28.5,61.65 180 top
R23  0.1  [1210]  84.78,31.98 0 top
R24  0.1  [1210]  49.03,32.17 180 top
R25  10  [1206]  84.78,36.11 180 top
R26  10  [1206]  49.28,35.55 180 top
R27  100k  [0603]  20.25,48.9 180 top
R28  0.01R  [0805]  29.88,52.65 180 top
R29  240Ω  [M0805]  232.86,74.78 270 top
R30  48Ω  [M0805]  236.16,88.41 270 top
R31  10k  [0603]  91.32,65.44 90 top
R32  10k  [0603]  133.29,81.09 270 top
R33  10  [1206]  156.5,36.02 0 top
R34  10  [1206]  120.75,36.02 0 top
R37  1M  [0603]  21.12,62.77 270 top
R38  1M  [0603]  18.38,62.77 270 top
R39  47k  [0603]  32.12,28.89 90 top
R40  47k  [0603]  56.38,64.89 180 top
R41  47k  [0603]  59.12,81.89 180 top
R42  9.53k  [0603]  62.38,64.64 0 top
R43  8.45k  [0603]  32.12,24.39 90 top
R44  2.74k  [0603]  63.12,81.89 0 top
R45  19.1k  [0603]  29.38,28.89 90 top
R46  100k  [0603]  27.12,28.89 270 top
R47  32.4k  [0603]  56.12,77.39 180 top
R48  100k  [0603]  59.12,79.14 0 top
R49  100k  [0603]  50.62,58.15 180 top
R50  7.15k  [0603]  55.38,60.9 180 top
R51  15k  [0603]  26.62,66.52 270 top
S1  EN11-HSM1BF20  [EN11HSM1BF20]  122.93,99.92 0 top
S2  TL3342F160QG  [SW_TL3342F160QG]  94.45,59.92 0 top
SCREEN1  OLED  [SIP-20]  75.48,106.07 0 top
SHUTTER  4N35S  [SOT23-6]  15.79,91.06 90 top
U1  TPD8S300RUKRRUK0020B_NV  [RUK0020B_NV]  13.75,55.02 0 top
U2  FT232RL-REEL  [SOP65P780X200-28N]  19.76,72.27 270 top
U3  CDCS502PWR  [SOP65P640X120-8N]  250.87,71.44 270 top
U4  LSM9DS1  [PQFN24P43_350X300X102L35X23N]  162.75,83.42 90 top
U5  TPS54336ADRCR  [DRC0010J]  51.75,80.14 0 top
U6  TPS54336ADRCR  [DRC0010J]  30.38,34.02 270 top
U7  TPS54336ADRCR  [DRC0010J]  50.5,63.9 0 top
U$27  CSD17309Q3  [DQG0008A]  36.25,51.52 270 top
U$28  CSD17309Q3  [DQG0008A]  40.75,51.52 270 top
U$29  TPS659821  [QFN50P800X800X100-57N]  23.25,56.52 0 top
X1  STEREOJACK  [STX3100]  0.52,90.46 0 top
Y1  7B-16.000MAAJ-T  [7B-16.000MAAJ-T_OSCSC500X320X105-4N]  256.4,71.67 180 top

## Tracks (layer width: path | path; a pad name or v marks a point on that pad's centre or on a via)
1.5V  (via drill 0.41)
  Top 0.254: IC5.14 251.86,47.33 | 251.86,47.33 251.86,47.96 251.99,48.08 252.97,48.08 253.1,47.96 253.1,47.33 IC5.17 253.23,45.5 v252.25,44.52 | v247.75,64.02 248.14,63.63 248.47,63.63 248.73,63.37 IC5.68 | v240.5,55.27 241.32,54.52 241.98,54.36 242.52,54.36 242.63,54.47 IC5.89 | 251.86,47.33 251.86,45.8 v251.89,45.77 | IC5.37 260.55,54.47 v261,54.02
  Top 1.016: 232.75,69.68 227.67,69.68 IC8.4 221.88,75.46 221.88,81.94 223.32,83.38 D3.C | 232.75,69.68 C22.+ v235.85,71.45 237.31,72.81 239.45,72.81 240.3,73.66 240.3,76.66 239.45,77.51 237.07,77.51 D2.A | R29.2 232.86,69.79 232.75,69.68
  Bottom 0.254: 251.07,46.59 251.19,46.47
  Bottom 1: 250.32,47.34 249.64,48.02 244.5,48.02 243.75,48.77 243.75,52.73 242.5,53.98 | 259.25,54.02 258.5,53.27 258.5,49.02 257.5,48.02 252.5,48.02 252.12,47.65 | v235.85,71.45 243.28,64.02 243.54,64.02 243.82,64.3 244.75,64.3 245.07,63.99 245.93,63.99 245.96,64.02 v247.75,64.02 248.54,64.02 249.57,65.05 252.75,65.05 254.75,63.05 260.43,63.05 261.03,62.45 261.03,61.59 261,61.56 261,61.02 261.47,60.55 261.93,60.55 262.53,59.95 262.53,59.09 261.93,58.49 261.5,58.49 259.72,56.7 259.72,55.84 261,54.56 v261,54.02
  Bottom 1.016: 240.5,55.05 v240.5,55.27 241.03,54.52 241.82,53.98 242.5,53.98 | 250.32,47.34 251.07,46.59 252.12,47.65 | 251.19,46.47 v251.89,45.77 252.25,45.41 v252.25,44.52 | v261,54.02 259.25,54.02
1.8V  (via drill 0.41)
  Top 0.254: v36,68.77 36,70.49 C68.1 | IC0.100 130.34,78.43 v130.25,78.52 | IC0.75 145.25,76.33 v145.25,76.77 151,76.77 v152,77.77 | IC0.6 127.17,72.6 v127,72.77 | IC0.22 126.83,64.6 | 126.83,64.6 v126.5,64.27 | IC0.21 127.33,65.1 126.83,64.6 | IC0.28 131.34,60.61 v130.5,59.77 | IC0.50 142.34,60.93 v143.25,60.02 | 110.12,64.39 110.22,64.49 C30.1
  Top 0.48: U$29.40 27.17,58.77
  Top 0.5: 27.17,58.77 v28.27,58.77
  Top 0.508: v126.5,64.27 126.28,64.49 C33.2 C34.2 C32.2 C31.2 C30.1 112.75,64.39 110.12,64.39 v99.5,53.77 | v125.5,67.77 125.4,67.87 C27.1 C29.1 C28.1 C26.1
  Top 1.016: IC8.3 223.32,78.03 D2.C 224.8,82.83 C21.1
  Bottom 0.254: 46,58.77 45.96,58.81 | 45.88,58.9 45.96,58.81 | 45.96,58.81 45.96,58.27 | D2.C 166.98,81.35 163.74,78.11 152.34,78.11 v152,77.77
  Bottom 0.508: v99.5,53.77 48.82,53.77 45.96,56.62 45.96,58.27 45.96,58.77 | 45.88,58.9 v36,68.77 30.04,62.81 30.04,62.69 29.58,62.23 29.46,62.23 28.27,61.04 v28.27,58.77
  pour Route3: 124.75,81.02 124.75,56.77 125.25,56.77 148.75,56.77 148.75,57.52 148.75,81.52 148.75,81.77 124.75,81.77
3.3V  (via drill 0.41)
  Top 0.254: U1.10 16.08,52.09 R1.2 | U$29.42 29.03,61.65 29.25,61.65 | 29.25,61.65 R22.1 C66.1 39.81,69.6 40.61,69.6 40.74,69.73 40.74,70.54 44.23,74.02 47.12,74.02 | R1.2 17.16,50.69 17.16,50 16.5,49.34 C2.2 16.52,48.9 R27.2 | U$29.53 21.5,60.94 21.84,61.28 21.84,62.68 v23.47,64.3 | v29.25,63.02 29.25,61.65 | R1.2 16.33,52.85 v16.5,53.02 | L5.2 44.86,76.51 C44.1 47.12,74.02 | 47.12,74.02 C52.1 51.81,74.54 51.81,74.56 51.94,74.69 55.62,74.69 57.74,76.81 57.74,76.91 R48.2 | U2.17 16.83,67.6 v16.5,67.27 | C45.1 16.88,28.64 v16.75,28.77 | IC2.29 222.95,39.57 v223,39.52 | v151.5,38.27 151.5,40.14 151.47,40.17 151.28,40.17 151.16,40.3 151.16,40.48 IC3.29 | IC4.29 v78.5,39.52 | U3.7 251.2,66.96 v251.39,66.77 | IC5.56 254.73,64.54 v254.25,65.02 | IC5.52 256.73,64.79 v256.25,65.27 | IC5.27 259.8,49.47 v260.25,49.02 | IC5.28 260.55,49.97 v261.5,49.02 | IC5.39 259.95,55.47 v260.75,56.27 | IC5.50 260,61.97 v260,62.02 | IC5.66 249.73,63.75 v250,64.02 | IC5.18 253.73,46.04 v254.25,45.52 | IC5.24 256.73,46 v256.25,45.52 | v241,57.02 242.41,57.02 242.57,56.86 242.57,55.73 242.7,55.6 243.32,55.6 IC5.87 | R6.1 v263,63.77 | IC6.20 227.03,53.5 v227.03,51.55 | IC6.21 228,53.2 v228,51.02 | IC6.5 227.75,65.77 v228,66.02 | U4.1 160.88,81.27 v160.5,81.27 | U4.23 161.09,82.77 | 161.09,82.77 v160.5,82.77 | U4.22 161.09,82.77 | C5.1 v161,89.02 | IC5.74 245.73,64.79 v245.5,65.02 | v151.25,69.52 C8.2 154.13,68.22 C7.1 | C7.1 v154.25,69.52 | 157.25,68.27 C74.1 160.02,68.1 C6.1 | 157.25,68.27 v157.25,69.52 | C6.1 v160.25,69.52 | C7.1 157.08,68.1 157.25,68.27 | C6.1 C75.1 162.75,68.12 v162.75,69.52 | v162.25,79.77 162.25,81.38 162.46,81.59 162.46,81.87 U4.3
  Top 0.508: IC1.5 236.8,91.97 v236.75,92.02 | IC1.11 236.4,83.37 v236.25,83.52
  Bottom 0.254: v29.25,63.02 27.97,64.3 v23.47,64.3 23.25,64.52 22.68,64.52 20.08,61.92 17.67,61.92 15.07,64.52 12.25,64.52 12.16,64.43 10.98,64.43 10.34,63.79 10.34,63 11.23,62.11 12.37,62.11 17.61,56.88 17.61,54.49 16.5,53.38 v16.5,53.02
  pour Route3 (isolate 0.635, rank 6): 0.5,109.77 0.5,0.52 268.25,0.52 269.25,109.77
3V3_VSENSE
  Top 0.254: U5.6 54.75,79.14 | 54.75,79.14 R48.1 | R48.1 | R47.2 54.75,77.92 54.75,79.14
5V  (via drill 0.41)
  Top 0.254: U$29.28 U$29.27 25.99,51.11 C72.1 24.99,50.4 v24.44,50.09 | U$29.14 18.44,53.27 v18.1,53.6 | v23.5,47.02 23.62,46.9 C69.1 24.87,44.53 C46.1 | U2.20 18.78,67.05 v18.76,67.03 18.76,66.72 | v22,74.27 22.03,74.3 U2.4 22.26,76.12 22.26,76.73 35.88,90.34 v49.75,90.34 | C46.1 26.75,42.4 C47.1 23.12,40.86 21.88,39.61 21.88,36.6 C51.1 24.05,34.48 25,33.52 25,30.17 R46.2 | L3.2 29.75,41.66 | 29.75,41.66 27.74,41.66 C46.1 | 29.75,41.66 28.12,40.03 28.12,37.96 | R11.2 136.18,95.42 R12.2 141.75,103.7 141.75,104 | v186.75,69.77 152.52,104 141.75,104 | 141.75,104 v137.75,104 R18.2 | v17.75,66.02 17.07,65.34 17.07,61.44 v17.67,60.84
  Bottom 0.254: v24.44,50.09 23.26,50.09 22.72,49.55 | 22.72,49.55 22.52,49.36 21.98,49.36 21.59,49.75 21.59,50.11 v18.1,53.6 18.1,58.92 17.25,59.77 17.25,60.65 v17.67,60.84 | 22.72,49.55 23.5,48.77 v23.5,47.02 | v22,74.27 18.76,71.03 v18.76,67.03 v17.75,66.02 | v49.75,90.34 53.5,90.34 70.34,107.19 73.26,107.19 73.65,106.8 73.65,106.65 SCREEN1.2 SCREEN1.3 76.06,106.65 76.06,106.8 76.45,107.19 97.31,107.19 98.42,106.07 135.68,106.07 v137.75,104 | J8.5 245.09,38.52 | 245.09,38.52 J13.5 J14.5 | 245.09,38.52 227.43,38.52 224.27,35.36 223.16,35.36 188.75,69.77 v186.75,69.77
5V_OUT  (via drill 0.41)
  Top 0.254: v147.25,45.52 147.13,45.41 83.45,45.41 83.02,45.84 82.48,45.84 82.05,45.41 80,45.41 | 152.62,45.52 154.91,45.52 155.23,45.84 155.77,45.84 156.09,45.52 v157,45.52 v219.25,45.52 | 224.45,45.39 226.54,45.39 226.98,45.82 227.86,45.82 v228.72,44.96
  Bottom 0.254: v147.25,45.52 154.91,45.52 155.23,45.84 155.77,45.84 156.09,45.52 v157,45.52 | v219.25,45.52 226.68,45.52 226.98,45.82 227.86,45.82 v228.72,44.96
5V_VSENSE
  Top 0.254: U6.6 29.38,30.77 | 29.38,30.77 R45.2 | R45.2 | 29.38,30.77 28.15,30.77 R46.1
12V_VSENSE  (via drill 0.41)
  Top 0.254: U7.6 52.88,62.9 v53,62.77 | R50.2 54.4,61.02 v53,61.02 53,59.67 R49.1
  Bottom 0.254: v53,62.77 v53,61.02
ANTENNA_GND  (via drill 0.41)  (7 unrouted)
  Top 0.254: v250.45,103.62 250.45,103.47 250.58,103.33
  Top 1.575: IC1.35 252.31,97.77 | 252.31,97.77 IC1.36 250.73,97.77 | 252.86,96.08 254.34,96.08 254.89,96.63 254.89,96.78 | 252.86,96.08 252.31,96.63 252.31,97.77 | IC1.33 254.89,96.78 | 250.73,97.77 250.58,97.92 250.58,102.78 | 250.58,102.78 250.58,103.33 251.38,104.14 251.38,105.9 250.13,107.16 248.37,107.16 247.12,105.9 247.12,104.14 247.92,103.33 247.92,102.78 | 249.3,95.44 248.2,95.44 247.61,96.03 247.61,97.51 247.92,97.82 247.92,102.78 | 249.3,95.44 249.3,93.26 | 252.86,96.08 251.04,96.08 | 251.04,96.08 250.4,95.44 249.3,95.44 | 251.04,96.08 251.04,97.46 250.73,97.77 | 260.74,96.08 256.86,96.08 256.16,96.78 254.89,96.78 | 260.74,96.08 261.44,96.78 261.88,96.78 IC1.29 261.9,95.66 | IC1.28 261.9,95.66 | 260.74,96.08 261.16,95.66 261.9,95.66 | 260.74,96.08 260.74,95.64 260.21,95.11 260.21,93.63 260.67,93.17 IC1.26 | J5.4 246.71,103.33 247.01,103.33 247.01,102.78 247.92,102.78 | J5.5 247.62,107.56 247.62,107.26 247.01,107.26 247.01,106.41 | J5.2 250.88,107.56 250.88,107.26 251.49,107.26 251.49,106.41 | J5.3 251.79,103.33 251.49,103.33 251.49,102.78 250.58,102.78
  other vias: 247.35,105.82 247.35,104.37 248.05,103.62 247.9,101.17 247.9,99.37 250.6,99.37 250.6,101.17 251.2,104.37 251.15,105.82 249.25,107.07
  pour Route2: 243.75,109.27 243.75,79.27 266.25,79.27 266.25,109.27
  pour Route3: 243.75,108.52 243.75,79.27 266.25,79.27 266.25,108.52
  pour Bottom: 243.75,108.52 243.75,79.27 266.25,79.27 266.25,108.52
ANTENNA_IN  (1 unrouted)
  Top 0.787: J5.1 249.25,96.82 IC1.1 | IC1.1
BOOT0
  Top 0.254: IC0.94 133.29,76.83 R32.2 133.08,80.45 JP1.1
CAMERA_FOCUS  (via drill 0.41)
  Top 0.254: R10.1 32.25,94.27 34,92.52 47.74,92.52 48.23,93 49.48,93 v49.75,93.27 | IC0.16 128.52,67.74 127.81,67.74 126.81,68.74 126.81,70.24 125.97,71.08 125,71.08 124.75,71.08 121.02,71.08 v119.75,69.82 | v118.5,88.52 113.75,93.27 v53.5,93.27
  Bottom 0.254: v49.75,93.27 v53.5,93.27 | v118.5,88.52 118.5,71.07 v119.75,69.82
CAMERA_GND
  Top 0.254: X1.5 14.02,91.06 SHUTTER.5 14.87,91.52 15.18,91.52 15.75,92.09 15.75,93.77 15.68,93.77 15.35,94.1 15.04,94.1 FOCUS.5
CAMERA_SHUTTER  (via drill 0.41)
  Top 0.254: R9.1 34.43,90.52 35.93,92.02 48.18,92.02 v48.5,92.34 | v52.5,92.34 53.14,92.34 53.23,92.43 60.75,92.43 61.01,92.43 112.84,92.43 v117.5,87.77 | IC0.15 128.52,68.24 127.81,68.24 127.16,68.9 127.16,70.38 126.11,71.43 120.88,71.43 120.47,71.02 v117.5,71.02
  Bottom 0.254: v48.5,92.34 v52.5,92.34 | v117.5,71.02 v117.5,87.77
CLOCK  (via drill 0.41)
  Top 0.25: IC3.16 v149,46.52 148.75,46.27 v81.75,46.27 | IC4.16 v76.5,46.77 | IC2.16 221,45.44 v221,46.52 154.75,46.52 v154.5,46.27
  Top 0.254: IC5.64 250.73,66.02 | 250.73,66.02 250.73,68.32 U3.6 | v225.32,52.54 225.32,51.45 228.16,48.61 228.16,46.63 v228.65,46.19 | v225.25,61.02 225.22,59.8 IC6.7 225.59,64.43 225.59,66.04 226.23,66.68 248.27,66.68 248.93,66.02 250.73,66.02
  Bottom 0.25: v149,46.52 149.25,46.27 v154.5,46.27 | v76.5,46.77 77,46.27 v81.75,46.27 | v221,46.52 221.13,46.19 v228.65,46.19
  Bottom 0.254: v225.32,52.54 225.25,52.62 v225.25,61.02
ENC1_A
  Top 0.254: IC5.3 246.23,46.48 242.56,42.82 242.56,36.59 J14.4
ENC1_B
  Top 0.254: IC5.4 246.73,46.5 242.91,42.68 242.91,37.32 244.36,35.86 245.83,35.86 J14.3
ENC1_N
  Top 0.254: IC5.5 247.23,46.51 243.25,42.53 243.25,41.01 246.32,37.83 246.32,36.34 246.9,35.86 248.37,35.86 J14.2
ENC2_A
  Top 0.254: J13.4 247.38,37.36 243.59,41.15 243.59,42.39 247.74,46.54 IC5.6
ENC2_B
  Top 0.254: IC5.7 248.23,46.54 243.93,42.25 243.93,41.29 244.61,40.61 246.33,40.61 J13.3
ENC2_N
  Top 0.254: J13.2 248.73,40.75 248.24,40.75 248.11,40.61 247.15,40.61 246.47,41.29 246.47,42.25 248.73,44.5 IC5.8
ENC3_A
  Top 0.254: IC5.10 249.73,43.87 J8.4
ENC3_B
  Top 0.254: IC5.11 250.23,41.83 J8.3
ENC3_N
  Top 0.254: IC5.13 251.23,43.25 J8.2
ENCODER_A  (via drill 0.41)
  Top 0.254: R14.2 137.64,101.38 v137.75,101.27 | v152,83.52 149.5,81.02 v149.5,78.14 | IC0.63 146.81,69.1 v150.39,72.68 155.5,72.68 C10.1
  Bottom 0.254: v137.75,101.27 141.5,97.52 141.5,92.02 149,84.52 152,84.52 v152,83.52 | v149.5,78.14 149.5,73.58 v150.39,72.68
ENCODER_B  (via drill 0.41)
  Top 0.254: R13.1 139.51,92.26 v140.75,91.02 | v151,83.52 148.44,80.96 v148.44,78.08 | IC0.64 146.21,69.6 147.34,70.73 147.34,71.52 v148.5,72.68 149.46,72.68 150.12,73.34 153.75,73.34 154.41,74 154.41,74.57 C11.1
  Bottom 0.254: v148.44,78.08 148.44,72.74 v148.5,72.68 | v140.75,91.02 148.25,83.52 v151,83.52
ENCODER_SWITCH  (via drill 0.41)
  Top 0.254: IC0.65 144.16,70.24 146.37,70.24 146.91,70.78 146.91,72.02 149.24,74.35 C12.1 150.63,74.9 v150.75,75.52 | R17.1 138.48,106.79 v139,106.27 | v153,83.52 150.75,81.27 v150.75,78.14
  Bottom 0.254: v139,106.27 141.84,103.43 141.84,92.52 149.5,84.86 152.14,84.86 152.34,84.66 152.34,84.18 v153,83.52 | v150.75,75.52 v150.75,78.14
FOCUS
  Top 0.254: FOCUS.4 8.27,95.51 X1.2
GND  (via drill 0.41, 0.41 pad 0.45)  (1 unrouted)
  Top 0.254: 7.75,58.02 P1.B12 6.43,58.52 v5.5,58.52 5.5,59.92 P1.S4 | 7.75,58.02 7.88,58.02 P1.A1 | 7.75,52.02 P1.B1 5.5,50.59 v5.5,50.52 5.5,50.12 P1.S3 | 7.75,52.02 7.88,52.02 P1.A12 | 7.75,58.02 8.6,58.87 P1.S1 | 7.75,52.02 8.6,51.17 P1.S2 | 12.38,47.15 C19.2 16.2,47.12 C2.1 17.4,47.17 v17.75,47.52 18.41,48.18 20.04,48.18 20.17,48.31 20.17,49.48 20.04,49.61 19.63,49.61 C63.2 | 12.38,47.15 v12,46.77 | R23.1 81.54,31.98 v81.5,32.02 | R20.2 117.76,32.03 v117.5,31.77 | R19.1 153.32,32.09 v153.25,32.02 | R24.2 46.15,32.17 v46,32.02 | IC3.13 150.5,43.27 150.62,43.15 | 150.62,43.15 IC3.33 152.5,41.27 | 152.5,41.27 IC3.32 152.5,40.27 v153,39.77 | 150.62,43.15 150.5,43.02 IC3.28 150.5,39.77 v150,39.27 | IC4.13 78,43.27 IC4.33 | IC4.33 78,42.77 IC4.28 77.84,40.48 77.84,40.3 77.72,40.17 77.53,40.17 76.5,39.14 v76.5,39.02 | 80,41.27 IC4.32 80.5,40.14 v80.5,39.52 | 80,41.27 IC4.1 81.25,41.27 v81.5,41.02 | 80,41.27 IC4.33 | 222.45,41.27 222.45,42.75 IC2.33 | 224.45,41.25 IC2.1 225.75,40.59 v225.75,40.52 | 224.45,41.25 IC2.33 | 224.45,41.25 IC2.32 224.45,39.82 v224.75,39.52 | IC2.13 222.45,43.25 IC2.33 | 152.5,41.27 IC3.1 153.5,41.27 v154,40.77 | U1.18 U1.21 | 13.25,54.52 12.95,54.22 U1.6 U1.7 | 13.25,54.52 U1.21 | U1.7 13.35,54.42 13.25,54.52 | U1.21 U1.8 U1.7 | U1.13 U1.21 | C1.1 12.38,47.55 12.38,47.15 | U1.7 13.35,52.62 v13.25,52.52 | U2.26 U2.25 21.8,68.87 21.8,69.48 21.67,69.61 19.79,69.61 19.66,69.48 19.66,68.87 U2.21 19.2,68.87 19.2,69.48 19.07,69.61 17.84,69.61 17.71,69.48 17.71,68.87 U2.18 17.48,69.54 v16.75,70.27 | U2.7 20.08,74.35 v20,74.27 | FOCUS.2 17.86,94.56 v18.57,95.27 | SHUTTER.2 17.54,91.06 v18.5,92.02
  Top 0.254: C13.2 39.25,44.02 v39.75,44.52 | C73.2 15.88,64.64 v15.75,64.77 | R38.1 18.38,64.64 v18.25,64.77 | R37.1 21.12,64.64 v21,64.77 | C71.2 33.12,55.65 v33.25,55.52 | C70.2 38.88,56.9 v39.25,56.52 | C72.2 27.23,51.5 v27.5,51.77 | D1.A 17.95,43.07 v16.75,44.27 | C35.2 C20.2 v13.25,35.27 | C36.2 C37.2 v18.25,35.27 | C69.2 29.62,46.9 v29.75,47.02 | C65.2 28.88,75.14 v29,75.27 | C67.2 32.12,75.14 v32.25,75.27 | C68.2 35.88,74.89 v36,75.02 | C64.1 39.62,74.64 v39.75,75.02 | C66.2 36.12,61.65 v36.25,61.77 | R21.1 11.12,67.64 v11.5,68.02 | C49.2 45.51,58.52 | 45.51,58.52 45.51,56.77 C48.2 | 45.51,58.52 v46.75,58.52 | 50.67,63.44 50.5,63.6 U7.11 50.5,66.17 C43.1 51.22,68.49 C42.1 | 50.67,63.44 50.97,63.14 50.97,62.6 v50.5,62.14 | U7.3 U7.4 | U7.4 U7.5 | U7.4 49.14,63.44 50.67,63.44 | U6.4 U6.5 | U6.4 29.88,34.52 U6.11 | U5.4 U5.5 | U5.4 51.25,79.64 U5.11 | U6.11 | U6.11 30.08,34.02 29.62,33.55 29.23,33.55 28.77,34.02 v28.62,34.02 | U5.11 | U5.11 51.75,79.85 52.22,79.39 52.22,79 51.75,78.54 v51.75,78.39 | C50.2 32.25,58.52 v32.75,59.02 | C53.1 v65.03,61.15 C54.1 | R50.1 55.5,61.62 v55.5,62.02 | R51.1 26.62,67.73 v27.75,67.86 | C58.2 v65.33,78.94 65.28,78.89 C57.2 | C44.2 49.12,76.39 v49.5,76.77 | C52.2 v53.75,74.02 | R47.1 56.97,78.26 v56.75,78.48 | R40.1 58.62,64.89 v58.75,65.02 | C41.1 36.59,32.27 C40.1 32.49,34.02 U6.11 | C47.2 26.75,38.89 C46.2 27,38.89 v27,37.77 | R39.1 32.12,26.89 v32.25,26.77 | R45.1 29.5,27.92 v29.5,26.77 | C51.2 v24,32.27 | C56.2 v29.38,22.52 29.38,22 C55.2 | -.1 24.97,102.05 v25.25,101.77 | C39.1 53.5,86.36 53.5,84.02 | 53.5,84.02 C38.1 53.63,84.02 v55,84.02 | U5.11 51.75,82.27 53.5,84.02 | 21.5,57.02 U$29.57 23.25,58.27 v24,59.02
  Top 0.254: C45.2 23.38,28.64 v23.5,28.77 | IC0.74 144.83,74.6 v145.5,75.27 | v132.25,78.52 131.51,77.78 131.13,77.78 130.84,77.48 IC0.99 | R32.1 133.29,83.48 v133,83.77 | IC0.20 127.42,65.6 126.62,66.39 v126.5,66.52 | IC0.49 141.84,60.61 v140.75,59.52 | C15.2 171.52,16.75 v171.5,16.77 | 224.45,41.25 222.47,41.25 | v221.25,39.02 221.25,39.42 221.98,40.15 222.17,40.15 222.29,40.28 222.29,40.46 IC2.28 | C17.2 v72.74,34.78 v72.75,34.77 | U3.5 249.16,67.77 v248.75,67.77 | Y1.4 253.8,69.82 v253.75,69.77 | Y1.2 v259.25,73.52 | U3.2 U3.3 | U3.3 U3.4 | U3.3 250.54,75.98 v250.5,76.02 | IC5.38 261.95,54.97 v262.25,55.27 | IC5.47 260.05,59.47 v260.5,59.02 | IC5.48 261.05,59.97 v261.5,59.52 | IC5.51 257.23,63.75 v258,64.52 | IC5.67 249.23,64.79 v248.25,65.77 | J8.1 254.34,41.77 253.19,40.61 252.23,40.61 251.55,41.29 251.55,42.44 250.73,43.27 250.73,47.02 | IC5.12 250.73,47.02 | 250.73,47.02 250.6,47.15 250.6,47.96 250.47,48.08 249.49,48.08 249.36,47.96 249.36,47.33 IC5.9 | IC5.25 258.25,46.18 v258.25,45.27 | IC5.88 242.3,54.97 v242.1,55.17 | IC5.75 244.7,63.27 v244.25,63.27 | IC6.22 230.29,53.07 v229.75,52.52 | IC6.8 223.94,65.58 v223.75,65.77 | IC6.6 226.49,65.53 v226.25,65.77 | U4.20 161.09,84.49 | 161.07,84.52 v160.5,84.52 | U4.19 161.09,84.49 | 161.09,84.49 161.07,84.52 | U4.18 161.12,84.52 161.07,84.52 | U4.16 162.53,85.32 | 162.53,85.52 162.53,85.98 v162.5,86.02 | U4.17 162.53,85.32 | 162.53,85.32 162.53,85.52 | 162.53,85.52 162.97,85.09 U4.15 U4.14 | C4.2 v156.25,81.52 | C3.2 v156.25,83.77 | C5.2 161.92,86.69 v162.25,87.02 | C12.2 153.67,74.35 v153.75,74.27 | C11.2 159.39,76.63 v159.5,76.52 | C10.2 159.36,73.66 v159.5,73.52 | C9.2 148.87,34.89 v148.75,34.77
  Top 0.254: IC5.1 244.55,46.52 v244,46.52 | U5.3 U5.4 | C25.2 138.56,96.08 v139,96.52 | C6.2 v160.25,65.02 | 157.25,66.77 C74.2 C7.2 | 157.25,66.77 v157.25,65.77 | C7.2 v154.25,65.77 | v151.25,66.02 C8.1 151.37,66.94 C7.2 | C6.2 157.85,66.17 157.25,66.77 | C6.2 C75.2 v163,65.02 | U6.3 U6.4 | v13.75,63.77 13.48,63.77 C62.1 | R41.1 60.25,82.17 v60.25,83.27
  Top 0.406: C28.2 C29.2 121.75,69.03 C27.2
  Top 0.5: R7.1 225.06,32.33 v225,32.27
  Top 0.508: 126.62,66.39 124.51,66.39 C33.1 C34.1 C32.1 C31.1 C30.2 111.07,66.2 v111,66.27 | 121.75,69.03 C28.2 C26.2 112.74,69.03 v112.5,69.27 | C29.2 C27.2 v125.99,69.03 v126,69.02 | v240.5,90.02 240.55,90.07 IC1.6 IC1.24 IC1.23 IC1.22 IC1.21 | v240.25,84.52 240.3,84.57 IC1.10 260.3,84.57 | v240.25,85.77 IC1.9 IC1.21 | IC1.12 240.4,82.37 v240.25,82.52 | IC1.15 254.25,81.27 v240.25,81.27 | v240.25,80.02 256.83,80.02 258.29,81.48 258.29,81.86 IC1.17 259.31,82.88 259.31,83.26 259.51,83.46 260.49,83.46 260.58,83.37 261.5,83.37 | IC1.21 262.41,85.26 262.79,85.26 262.99,85.06 262.99,84.08 262.79,83.88 262.41,83.88 IC1.19 261.5,83.37 | 260.3,84.57 261.5,83.37 | IC1.21 261.5,85.77 260.3,84.57 | v100.25,58.02 S2.2 S2.1 v88.5,58.02 | C24.2 95.64,66.27 v96.75,66.27
  Top 1.016: C23.- 244.5,73.75 v243.01,72.26 C22.- | C21.2 233.71,91.81 R30.1
  Route2 0.254: v5.5,58.52 5.85,58.87 5.85,59.62 6.25,60.02 6.25,61.52 6.75,62.02 7.5,62.02 | v5.5,50.52 5.5,48.52 6.75,47.27 | v81.5,32.02 81.5,32.52 81.75,32.77 | v117.5,31.77 117.5,30.77 | v153.25,32.02 153.25,31.02 | v46,32.02 46,31.02 | v154,40.77 153,40.77 v153,39.77 | v150,39.27 150.25,39.77 150,40.02 | v13.25,52.52 13.75,52.02 14,52.02 | v16.75,70.27 17,70.52 17.5,70.52 | 225.25,38.48 225.25,33.27
  Route2 0.5: v225,32.27 225,33.02 225.25,33.27 | v229.75,52.52 229.75,53.52 | 224.5,62.77 224.5,63.52
  other vias: 130.85,73.57 131.85,73.57 132.85,73.57 133.85,73.57 134.85,73.57 135.85,73.57 136.85,73.57 137.85,73.57 138.85,73.57 139.85,73.57 140.85,73.57 141.85,73.57 130.85,74.57 131.85,74.57 132.85,74.57 133.85,74.57 134.85,74.57 135.85,74.57 136.85,74.57 137.85,74.57 138.85,74.57 139.85,74.57 140.85,74.57 141.85,74.57 130.85,72.57 131.85,72.57 132.85,72.57 133.85,72.57 134.85,72.57 135.85,72.57 136.85,72.57 137.85,72.57 138.85,72.57 139.85,72.57 140.85,72.57 141.85,72.57 130.85,71.57 131.85,71.57 132.85,71.57 133.85,71.57 134.85,71.57 135.85,71.57 136.85,71.57 137.85,71.57 138.85,71.57 139.85,71.57 140.85,71.57 141.85,71.57 130.85,70.57 131.85,70.57 132.85,70.57 133.85,70.57 134.85,70.57 135.85,70.57 136.85,70.57 137.85,70.57 138.85,70.57 139.85,70.57 140.85,70.57 141.85,70.57 130.85,69.57 131.85,69.57 132.85,69.57 133.85,69.57 134.85,69.57 135.85,69.57 136.85,69.57 137.85,69.57 138.85,69.57 139.85,69.57 140.85,69.57 141.85,69.57 130.85,63.57 131.85,63.57 132.85,63.57 133.85,63.57 134.85,63.57 135.85,63.57 136.85,63.57 137.85,63.57 138.85,63.57 139.85,63.57 140.85,63.57 141.85,63.57 130.85,64.57 131.85,64.57 132.85,64.57 133.85,64.57 134.85,64.57 135.85,64.57 136.85,64.57 137.85,64.57 138.85,64.57 139.85,64.57 140.85,64.57 141.85,64.57 130.85,65.57 131.85,65.57 132.85,65.57 133.85,65.57 134.85,65.57 135.85,65.57 136.85,65.57 137.85,65.57 138.85,65.57 139.85,65.57 140.85,65.57 141.85,65.57 130.85,66.57 131.85,66.57 132.85,66.57 133.85,66.57 134.85,66.57 135.85,66.57 136.85,66.57 137.85,66.57 138.85,66.57 139.85,66.57 140.85,66.57 141.85,66.57 130.85,67.57 131.85,67.57 132.85,67.57 133.85,67.57 134.85,67.57 135.85,67.57 136.85,67.57 137.85,67.57 138.85,67.57 139.85,67.57 140.85,67.57 141.85,67.57 130.85,68.57 131.85,68.57 132.85,68.57 133.85,68.57 134.85,68.57 135.85,68.57 136.85,68.57 137.85,68.57 138.85,68.57 139.85,68.57 140.85,68.57 141.85,68.57 245.85,59.57 246.85,59.57 247.85,59.57 248.85,59.57 249.85,59.57 250.85,59.57 251.85,59.57 252.85,59.57 253.85,59.57 254.85,59.57 255.85,59.57 256.85,59.57 245.85,60.57 246.85,60.57 247.85,60.57 248.85,60.57 249.85,60.57 250.85,60.57 251.85,60.57 252.85,60.57 253.85,60.57 254.85,60.57 255.85,60.57 256.85,60.57 245.85,58.57 246.85,58.57 247.85,58.57 248.85,58.57 249.85,58.57 250.85,58.57 251.85,58.57 252.85,58.57 253.85,58.57 254.85,58.57 255.85,58.57 256.85,58.57 245.85,57.57 246.85,57.57 247.85,57.57 248.85,57.57 249.85,57.57 250.85,57.57 251.85,57.57 252.85,57.57 253.85,57.57 254.85,57.57 255.85,57.57 256.85,57.57 245.85,56.57 246.85,56.57 247.85,56.57 248.85,56.57 249.85,56.57 251.85,56.57 252.85,56.57 253.85,56.57 254.85,56.57 255.85,56.57 256.85,56.57 245.85,55.57 246.85,55.57 247.85,55.57 248.85,55.57 249.85,55.57 250.85,55.57 251.85,55.57 252.85,55.57 253.85,55.57 254.85,55.57 255.85,55.57 256.85,55.57 245.85,49.57 246.85,49.57 247.85,49.57 248.85,49.57 249.85,49.57 250.85,49.57 251.85,49.57 252.85,49.57 253.85,49.57 254.85,49.57 255.85,49.57 256.85,49.57 245.85,50.57 246.85,50.57 247.85,50.57 248.85,50.57 249.85,50.57 250.85,50.57 251.85,50.57 252.85,50.57 253.85,50.57 254.85,50.57 255.85,50.57 256.85,50.57 245.85,51.57 246.85,51.57 247.85,51.57 248.85,51.57 249.85,51.57 250.85,51.57 251.85,51.57 252.85,51.57 253.85,51.57 254.85,51.57 255.85,51.57 256.85,51.57 245.85,52.57 246.85,52.57 247.85,52.57 248.85,52.57 249.85,52.57 250.85,52.57 251.85,52.57 252.85,52.57 253.85,52.57 254.85,52.57 255.85,52.57 256.85,52.57 245.85,53.57 246.85,53.57 247.85,53.57 248.85,53.57 249.85,53.57 250.85,53.57 251.85,53.57 252.85,53.57 253.85,53.57 254.85,53.57 255.85,53.57 256.85,53.57 245.85,54.57 246.85,54.57 247.85,54.57 248.85,54.57 249.85,54.57 250.85,54.57 251.85,54.57 252.85,54.57 253.85,54.57 254.85,54.57 255.85,54.57 256.85,54.57 250.84,56.54
  pour Route2 (isolate 0.635, rank 6): 0.5,0.52 269.25,0.52 269.5,109.77 0.5,109.77
  pour Top (no thermals): 130.25,75.02 130.25,63.02 142.25,63.02 142.25,75.02
  pour Top (no thermals): 245.25,61.02 245.25,49.02 257.25,49.02 257.25,61.02
HV_GATE1
  Top 0.254: U$27.4 34.06,54.26 U$29.31
HV_GATE2
  Top 0.254: U$29.32 27.3,54.63 36.54,54.63 38.12,53.05 U$28.4
HV_SOURCE
  Top 0.254: U$29.33 28.01,55.28 28.25,55.52 | U$29.34 28.01,55.76 28.25,55.52 | 28.25,55.52 30,55.52 | 30,55.52 30.15,55.52 C71.1 31.52,56.9 33,56.9 | 33,56.9 33.75,56.9 | 33.75,56.9 C70.1 | 33.75,56.9 34.37,57.52 | 33,56.9 36.75,60.65 40,60.65 | 40,60.65 C49.1 41.99,63.15 L4.2 43.65,64.27 44.16,63.76 44.16,63.49 44.37,63.29 44.83,63.29 46.36,61.76 46.36,61.56 R49.2 | C48.1 40,58.52 40,60.65 | C50.1 30.3,55.82 30,55.52
JTCK
  Top 0.254: IC0.76 154.12,88.56 J2.4
JTDI
  Top 0.254: IC0.77 141.98,76.92 141.98,77.63 152.74,88.38 152.74,94.73 152.06,95.41 151.1,95.41 149.95,94.25 J2.8
JTDO
  Top 0.254: IC0.89 135.84,78.27 135.84,78.51 135.84,83.11 145.75,93.02 150.35,93.02 J2.6
JTMS
  Top 0.254: IC0.72 145.89,73.6 148.56,76.27 151.5,76.27 155.59,80.36 155.59,84.04 156.66,85.11 J2.2
LDO_3V3
  Top 0.254: U$29.51 22.49,60.96 24.4,62.87 25.58,62.87 27.17,64.45 28.68,64.45 28.88,64.64 C65.1
N$1
  Top 0.254: U$29.55 20.75,60.43 | 20.75,60.43 U$29.54 | 20.75,60.43 20.75,61.55 R37.2
N$4  (via drill 0.41)
  Top 0.254: U$29.22 23.5,51.8 v23.89,51.41 | R27.1 21.98,50.02 v22.25,50.02
  Bottom 0.254: v22.25,50.02 23.64,51.41 v23.89,51.41
N$5
  Top 0.254: U$29.48 24.13,60.55 24.13,60.93 27.31,64.11 32.59,64.11 39.1,70.62 C64.2
N$7
  Top 0.254: C4.1 159.4,82.34 160,82.34 160.23,82.11 160.77,82.11 161,82.34 U4.24
N$8
  Top 0.254: U4.21 159.24,83.63 C3.1
N$11
  Top 1.016: Q5.R 200.25,26.41 | 200.25,26.41 202.53,26.41 207.09,21.85 Q6.R | 200.25,26.41 200.25,30.52 198.5,32.27 196,32.27 | 196,32.27 R8.1 | 196,32.27 196,33.55 R16.1
N$12
  Top 1.016: Q11.R 164,26.41 | 164,26.41 166.6,26.41 171.16,21.85 Q12.R | 164,26.41 164,30.27 162.18,32.09 160.5,32.09 | 160.5,32.09 R19.2 | 160.5,32.09 160.5,33.42 R33.2
N$13
  Top 1.016: Q13.R 128.5,26.41 | 128.5,26.41 131.04,26.41 135.6,21.85 Q14.R | 128.5,26.41 128.5,29.77 126.24,32.03 124.25,32.03 | 124.25,32.03 R20.1 | 124.25,32.03 124.25,33.92 R34.2
N$14
  Top 1.016: Q3.R 235.5,26.41 | 235.5,26.41 238.09,26.41 242.65,21.85 Q4.R | 235.5,26.41 235.5,29.77 232.94,32.33 231.5,32.33 | 231.5,32.33 R7.2 | 231.5,32.33 231.5,34.36 R15.1
N$15
  Top 1.016: Q19.R 92.25,26.41 | 92.25,26.41 95.12,26.41 99.68,21.85 Q20.R | 92.25,26.41 92.25,30.27 90.54,31.98 89.25,31.98 | 89.25,31.98 R23.2 | 89.25,31.98 89.25,33.04 R25.1
N$16
  Top 1.016: Q21.R 56.25,26.41 | 56.25,26.41 59.56,26.41 64.12,21.85 Q22.R | 56.25,26.41 56.25,30.27 54.35,32.17 52.75,32.17 | 52.75,32.17 R24.1 | 52.75,32.17 52.75,33.48 R26.1
N$17
  Top 0.254: R10.2 21.56,93.61 FOCUS.1
N$18
  Top 0.254: SHUTTER.1 21.75,90.11 R9.2
N$19
  Top 0.254: S1.4 123.85,104 R18.1 134.36,104.17 R17.2
N$20
  Top 0.254: S1.1 125.34,97.33 128.65,97.33 129.86,98.54 134.07,98.54 R12.1 134.48,101.23 R14.1
N$21
  Top 0.254: S1.3 125.59,92.26 R13.2 134.47,95.29 R11.1
N$22  (via drill 0.41)
  Top 0.254: U$29.19 U$29.20 22.63,52.47 22.63,51.74 23.62,50.75 24.17,50.75 24.55,51.14 24.55,51.69 24.5,51.74 | 24.25,51.99 24.13,52.11 24.13,52.49 U$29.23 | 24.25,51.99 | 24.25,51.99 24.5,51.99 | 24.5,51.99 25,51.99 | 25,51.99 25.24,51.99 25.37,52.11 25.37,52.47 U$29.26 25.62,52.72 | 24.5,51.74 24.25,51.99 | U$29.1 19.34,60.68 v19.25,60.52 | U$29.38 27.3,57.9 28.19,57.9 | U$29.41 27.58,59.26 27.74,59.43 28.54,59.43 28.93,59.04 28.93,58.49 28.34,57.9 28.19,57.9 | 24.5,51.74 24.5,51.99 | 25,51.99 25,51.66 v24.86,51.52 | v11.25,63.77 11.12,63.9 R21.2 | 28.19,57.9 v28.29,57.8
  Bottom 0.254: v24.86,51.52 24.86,55.16 | 24.86,55.16 v19.25,60.52 18.92,60.52 17.94,61.5 17.39,61.5 16.42,60.52 15,60.52 12.09,63.43 11.59,63.43 v11.25,63.77 | 24.86,55.16 27.5,57.8 v28.29,57.8
N$25
  Top 0.254: IC5.55 255.36,62.61 255.36,61.98 255.49,61.86 257.94,61.86 | 257.94,61.86 R6.2 | IC5.49 258.87,60.6 258.24,60.6 258.12,60.73 258.12,61.68 257.94,61.86
N$28
  Top 0.254: U$27.5 U$27.6 U$27.7 U$27.8 U$28.5 U$28.6 U$28.7 U$28.8
N$30
  Top 0.254: C23.+ 236.61,75.16 236.5,75.27
  Top 1.016: 236.75,75.02 236.5,75.27 236.04,75.73 R29.1 231.77,76.82 IC8.1 229.13,81.22 D3.A 234.27,85.57 R30.2
N$31
  Top 0.254: U$29.49 U$29.50
N$32
  Top 0.508: R31.1 91.3,64.57 S2.3 S2.4
N$34
  Top 0.254: 26.23,61.05 26.36,60.93 26.36,60.57 U$29.43 | 26.23,61.05 25.27,61.05 25.14,60.93 25.14,60.57 U$29.46 | 26.23,61.05 27.06,61.05 R22.2
N$35
  Top 0.254: U$29.2 19.2,59.4 18.84,59.4 18.38,59.87 R38.2
N$39
  Top 0.254: U5.10 53.9,81.89 R41.2
N$40
  Top 0.254: U6.10 32.12,31.87 R39.2
N$41
  Top 0.254: U7.10 R40.2
N$42
  Top 0.254: L4.1 47.75,64.27 | 47.75,64.27 48.98,64.27 U7.2 | 47.75,64.27 47.75,62.8 C61.2
N$43
  Top 0.254: C73.1 18.64,58.78 U$29.3
N$44
  Top 0.254: L3.1 30.88,39.63 30.88,36.27 | 30.88,36.27 U6.2 | 30.88,36.27 28.27,36.27 C60.2
N$45
  Top 0.254: U$29.52 22.01,60.96 24.31,63.27 25.5,63.27 26.62,64.4 R51.2
N$48
  Top 0.254: L5.1 49.75,80.64 | 49.75,80.64 U5.2 | C59.2 49.75,78.3 49.75,80.64
N$49
  Top 0.254: C61.1 52.47,62.02 54,62.02 54.5,62.52 54.5,63.77 53.88,64.39 U7.9
N$50  (via drill 0.41)
  Top 0.254: C59.1 54,78.05 v54,78.48 | U5.9 53.31,80.81 53.54,80.81 53.8,81.07 v54.01,81.07
  Bottom 0.254: v54,78.48 v54,81.06 v54.01,81.07
N$52  (via drill 0.41)
  Top 0.254: U$29.56 20,62.39 v19.81,62.58 | v32.25,69.02 32.12,69.14 C67.1
  Bottom 0.254: v19.81,62.58 26.25,69.02 v32.25,69.02
N$53  (via drill 0.41)
  Top 0.254: U6.9 v30.88,31.66 | v28.5,32.02 27.35,33.17 C60.1
  Bottom 0.254: v30.88,31.66 28.86,31.66 v28.5,32.02
N$54
  Top 0.254: C53.2 61.53,61.35 R42.1
N$57  (via drill 0.41)
  Top 0.254: U7.7 52.06,63.56 52.29,63.56 52.47,63.74 v53.5,63.74 | R42.2 64.25,64.64 | 64.25,64.64 64.53,64.64 C54.2 | v63.75,63.27 64.25,63.77 64.25,64.64
  Bottom 0.254: v53.5,63.74 63.28,63.74 v63.75,63.27
N$58
  Top 0.254: R43.1 32.12,22.25 C55.1
N$59
  Top 0.254: R43.2 29.58,25.25 C56.1 30.16,25.83 30.16,30.32 29.88,30.6 U6.7
N$62
  Top 0.254: R44.1 62.28,79.09 C57.1
N$63  (via drill 0.41)
  Top 0.254: C58.1 65.28,81.89 R44.2 63.97,80.49 v63.75,80.27 | v61,80.27 60.59,79.86 57.64,79.86 57.42,79.64 U5.7
  Bottom 0.254: v61,80.27 v63.75,80.27
N$64
  Top 0.254: U1.9 14.15,52.54 R1.1
N$66  (via drill 0.41)
  Top 0.254: v11,54.55 11.46,55.02 U1.3 | v11.75,52.27 11.75,50.62 C1.2
  Bottom 0.254: v11,54.55 11.75,53.8 v11.75,52.27
NJTRST
  Top 0.254: IC0.90 135.34,83.09 144.88,92.64 | 144.88,92.64 J2.10 | 144.88,92.64 143.46,94.06 C25.1
NRST  (via drill 0.41)
  Top 0.254: v48.5,88.36 37.85,88.36 24.4,74.91 24.4,67.8 22.97,66.37 18.49,66.37 18.1,66.76 18.1,67.31 18.13,67.33 U2.19 | v54.5,88.36 62.17,88.36 78.77,71.77 90.25,71.77 | IC0.14 128.52,68.74 127.81,68.74 127.5,69.05 127.5,70.52 126.25,71.77 v109,71.77 90.25,71.77 | v64.75,94.02 65,93.77 89.25,93.77 92.03,96.55 SCREEN1.16 | IC5.92 241.82,52.97 234.99,59.8 226.32,59.8 v226,60.12 | v225.91,57.02 223.15,57.02 222.15,56.02 220.08,56.02 219.5,56.6 219.5,57.27 219.34,57.43 147.16,57.43 143.94,54.21 134.03,54.21 133.47,54.77 v116.75,54.77 | R31.2 91.32,70.7 90.25,71.77
  Top 0.508: R31.2 93.64,66.29 C24.1
  Bottom 0.254: v48.5,88.36 v54.5,88.36 60.16,94.02 v64.75,94.02 | v226,60.12 226,57.11 v225.91,57.02 | v109,71.77 113.56,67.21 113.56,57.24 114.65,56.15 115.37,56.15 v116.75,54.77
NSS429
  Top 0.254: IC5.95 243.32,51.6 242.7,51.6 234.84,59.46 225.08,59.46 225.07,59.47 225.06,59.47 224.97,59.57 223.41,61.12 223.41,63.31 IC6.9
PRE_VBUS  (via drill 0.41)
  Top 0.254: U$28.3 U$28.2 41.5,53.05 | 41.5,53.05 U$28.1 | 41.5,53.05 41.5,52.95 42.24,52.21 42.24,49.53 41.98,49.27 28.93,49.27 28.77,49.43 28.23,49.43 28.07,49.27 24.33,49.27 22.33,51.27 | 22.33,51.27 U$29.17 U$29.18 | v16.5,50.27 16.15,49.92 C19.1 11.8,49.92 11.22,49.34 11.22,48.98 10.92,48.69 9.91,48.69 9.78,48.56 9.78,47.9 FB1.1 | v20.5,50.27 22.33,51.27
  Bottom 0.254: v16.5,50.27 v20.5,50.27
REF0  (via drill 0.41)
  Top 0.254: IC5.34 259.14,52.84 259.87,52.84 262.16,50.54 262.16,48.75 262,48.59 262,36.89 255.73,30.61 244.61,30.61 243.75,31.48 243.75,34.91 242.22,36.44 242.22,43.8 233.5,52.52 v233.5,57.02 | v231.75,62.02 231.56,62.21 IC6.2
  Bottom 0.254: v233.5,57.02 233.5,60.27 v231.75,62.02